# Altium schematic sheet PCIE Connector.SchDoc
size A4; SheetNumber: 25; SheetTotal: 26
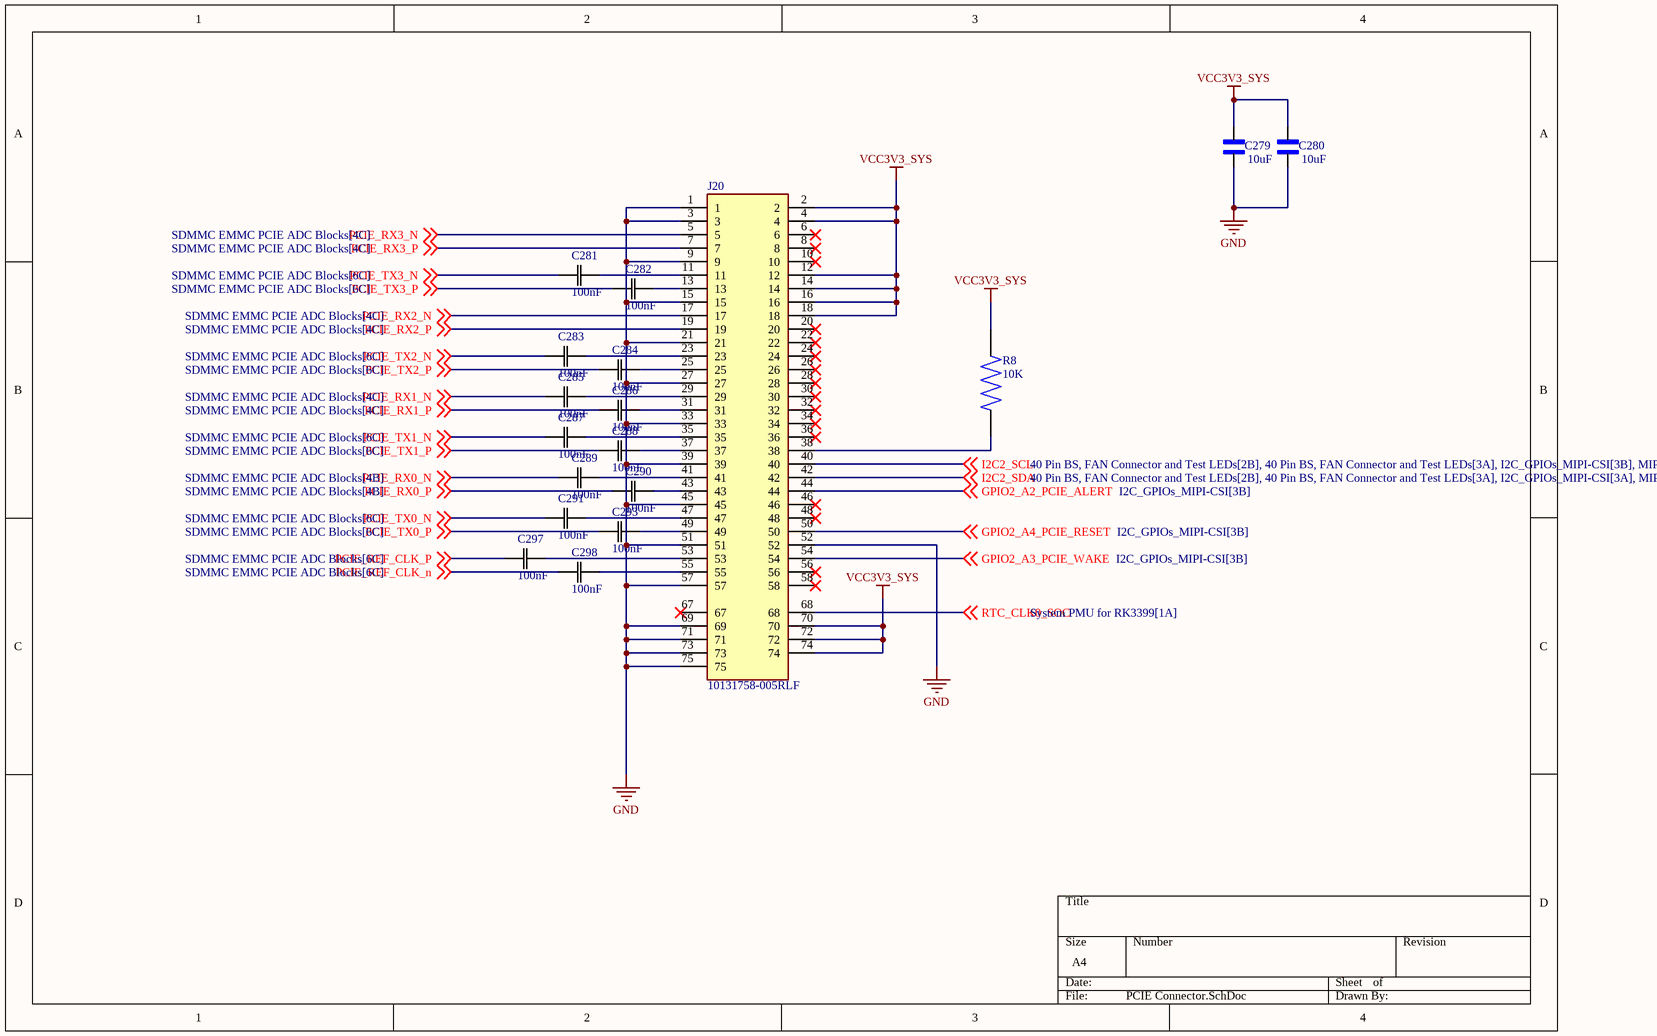
[diagram p0: PCIE Connector.SchDoc]

## Parts
C279  10uF  [CAPC1005X70N]
C280  10uF  [CAPC1005X70N]
C281  100nF  [CAP_1005_TDK]
C282  100nF  [CAP_1005_TDK]
C283  100nF  [CAP_1005_TDK]
C284  100nF  [CAP_1005_TDK]
C285  100nF  [CAP_1005_TDK]
C286  100nF  [CAP_1005_TDK]
C287  100nF  [CAP_1005_TDK]
C288  100nF  [CAP_1005_TDK]
C289  100nF  [CAP_1005_TDK]
C290  100nF  [CAP_1005_TDK]
C291  100nF  [CAP_1005_TDK]
C293  100nF  [CAP_1005_TDK]
C297  100nF  [CAP_1005_TDK]
C298  100nF  [CAP_1005_TDK]
J20  10131758-005RLF  [AMPHENOL_10131758-005RLF]
R8  10K  [RES_ERA3ARB103V]

## Nets
GND: C279.1 C280.1 J20.1 J20.3 J20.9 J20.15 J20.21 J20.27 J20.33 J20.39 J20.45 J20.51 J20.52 J20.57 J20.69 J20.71 J20.73 J20.75
VCC3V3_SYS: C279.2 C280.2 J20.2 J20.4 J20.12 J20.14 J20.16 J20.18 J20.70 J20.72 J20.74 R8.1
GPIO2_A2_PCIE_ALERT: J20.44 ; off-sheet GPIO2_A2_PCIE_ALERT
GPIO2_A3_PCIE_WAKE: J20.54 ; off-sheet GPIO2_A3_PCIE_WAKE
GPIO2_A4_PCIE_RESET: J20.50 ; off-sheet GPIO2_A4_PCIE_RESET
I2C2_SCL: J20.40 ; off-sheet I2C2_SCL
I2C2_SDA: J20.42 ; off-sheet I2C2_SDA
PCIE_REF_CLK_n: C298.2 ; off-sheet PCIE_REF_CLK_n
PCIE_REF_CLK_P: C297.2 ; off-sheet PCIE_REF_CLK_P
PCIE_RX0_N: C289.2 ; off-sheet PCIE_RX0_N
PCIE_RX0_P: C290.2 ; off-sheet PCIE_RX0_P
PCIE_RX1_N: C285.2 ; off-sheet PCIE_RX1_N
PCIE_RX1_P: C286.2 ; off-sheet PCIE_RX1_P
PCIE_RX2_N: J20.17 ; off-sheet PCIE_RX2_N
PCIE_RX2_P: J20.19 ; off-sheet PCIE_RX2_P
PCIE_RX3_N: J20.5 ; off-sheet PCIE_RX3_N
PCIE_RX3_P: J20.7 ; off-sheet PCIE_RX3_P
PCIE_TX0_N: C291.2 ; off-sheet PCIE_TX0_N
PCIE_TX0_P: C293.2 ; off-sheet PCIE_TX0_P
PCIE_TX1_N: C287.2 ; off-sheet PCIE_TX1_N
PCIE_TX1_P: C288.2 ; off-sheet PCIE_TX1_P
PCIE_TX2_N: C283.2 ; off-sheet PCIE_TX2_N
PCIE_TX2_P: C284.2 ; off-sheet PCIE_TX2_P
PCIE_TX3_N: C281.2 ; off-sheet PCIE_TX3_N
PCIE_TX3_P: C282.2 ; off-sheet PCIE_TX3_P
RTC_CLK0_SOC: J20.68 ; off-sheet RTC_CLK0_SOC
NetC281_1: C281.1 J20.11
NetC282_1: C282.1 J20.13
NetC283_1: C283.1 J20.23
NetC284_1: C284.1 J20.25
NetC285_1: C285.1 J20.29
NetC286_1: C286.1 J20.31
NetC287_1: C287.1 J20.35
NetC288_1: C288.1 J20.37
NetC289_1: C289.1 J20.41
NetC290_1: C290.1 J20.43
NetC291_1: C291.1 J20.47
NetC293_1: C293.1 J20.49
NetC297_1: C297.1 J20.53
NetC298_1: C298.1 J20.55
NetJ20_38: J20.38 R8.2

Not connected (* = marked no-connect by the designer): J20 6* 8* 10* 20* 22* 24* 26* 28* 30* 32* 34* 36* 46* 48* 56* 58* 67*

## Library data of the parts
C279 C280 = CL05A106MQ5NUNC: 10 ÂµF Â±20% 6.3V Ceramic Capacitor X5R 0402 (1005 Metric); MF: Samsung; SnapEDA_Link: https://www.snapeda.com/parts/CL05A106MQ5NUNC/Samsung/view-part/?ref=snap; Package: SMD-2 Samsung; Value: *; MP: CL05A106MQ5NUNC; Check_prices: https://www.snapeda.com/parts/CL05A106MQ5NUNC/Samsung/view-part/?ref=eda
C281-C291 C293 C297 C298 = C1005X7R1H104M050BB: Description; Manufacturer_Name: TDK; Copyright: Copyright (C) 2025 Ultra Librarian. All rights reserved.; Manufacturer_Part_Number: C1005X7R1H104M050BB
J20 = 10131758-005RLF: PCIe M.2, Storage and Server Connector, H8.50mm, Key M, 0.76&mu;m (30.000&mu;in) Gold Plating, 0.50mm Pitch; MF: Amphenol; Package: None; Price: None; Check_prices: https://www.snapeda.com/parts/10131758-005RLF/Amphenol/view-part/?ref=eda; Value: *; SnapEDA_Link: https://www.snapeda.com/parts/10131758-005RLF/Amphenol/view-part/?ref=snap; MP: 10131758-005RLF; Availability: In Stock; Purchase-URL: https://pricing.snapeda.com/search?q=10131758-005RLF&ref=eda
R8 = ERA3ARB103V: MP: ERA3ARB103V; Availability: Unavailable; Package: None; Value: *; Price: None